# EAGLE design SwitchCombo (EAGLE 9.6.2)
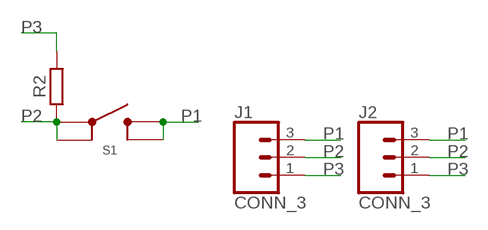
[diagram p0: schematic, sheet 1]

## Parts
J1  CONN_3  [1X03]
J2  CONN_3  [1X03]
R2  10k  R-EU_TH_0.4"  [R_TH_0.4"]
S1  BUTTON6X6_TH  [SWITCH_6MM_TH]

## Nets
P1: J1.3 J2.3 S1.3 S1.4
P2: J1.2 J2.2 R2.P$1 S1.1 S1.2
P3: J1.1 J2.1 R2.P$2

## Library data of the parts
J1 J2 = bschulz:CONN_3: Genaric 3 terminal header Digikey 2.54_SCREW <https://www.digikey.com/product-detail/en/on-shore-technology-inc/OSTVN03A150/ED10562-ND/1588863> 3.5_SCREW <https://www.digikey.com/product-detail/en/on-shore-technology-inc/OSTTE030161/ED2636-ND/614585>
R2 = bschulz_passives:R-EU_: RESISTOR, European symbol Digikey Parts: Yageo, 0402 <https://www.digikey.com/products/en/resistors/chip-resistor-surface-mount/52?k=&pkeyword=&sv=0&s=4356&sf=1&FV=-1%7C13%2C7%7C2%2C1291%7C39157%2C1989%7C0%2C-8%7C52%2C3%7C1131%2C3%7C2503&quantity=&ColumnSort=0&page=1&stock=1&pageSize=25> Yageo, 0603 <https://www.digikey.com/products/en/resistors/chip-resistor-surface-mount/52?k=&pkeyword=&sv=0&pv1291=39245&sf=1&FV=-5%7C4356%2C-5%7C47360%2C-8%7C52%2C-1%7C13%2C7%7C2%2C1989%7C0&quantity=10&ColumnSort=1000011&page=1&stock=1&pageSize=25> Panasonic, 0603 <https://www.digikey.com/products/en/resistors/chip-resistor-surface-mount/52?k=&pkeyword=&pv252=68&sf=0&FV=ffec373d%2C1c0002%2C142c040c%2C1f140000%2Cffe00034%2C80002%2Cc0001&quantity=&ColumnSort=0&page=1&stock=1&pageSize=25> Panasonic, precision, 0603 <https://www.digikey.com/products/en/resistors/chip-resistor-surface-mount/52?FV=ffec4907%2Cfffc000a%2Cc0172%2C142c040c%2C1f140000%2Cffe00034%2C1c0002&quantity=100&ColumnSort=2085&page=1&stock=1&pageSize=25> Panasonic, 0805 <https://www.digikey.com/products/en/resistors/chip-resistor-surface-mount/52?k=&pkeyword=&pv3=1&sf=0&FV=ffec373d%2C1c0002%2C1f140000%2Cffe00034%2C142c040d&quantity=&ColumnSort=0&page=1&stock=1&pageSize=25> Rohm, current sense <https://www.digikey.com/products/en/resistors/chip-resistor-surface-mount/52?k=&pkeyword=&pv3=1&sf=0&FV=ffecb688%2C1f140000%2Cffe00034%2C1c0002&quantity=&ColumnSort=0&page=1&stock=1&pageSize=25> Vishay, pulse proof automotive <https://www.digikey.com/products/en/resistors/chip-resistor-surface-mount/52?k=&pkeyword=&pv7=2&sf=0&FV=ffec5d6b%2Cffe00034%2C1f140000&quantity=&ColumnSort=0&page=1&stock=1&pageSize=25>
S1 = bschulz:BUTTON: Genaric SPST Push button; DIGIKEY: 450-1650-ND; MF: TE Connectivity; MPN: 1825910-6

## Board
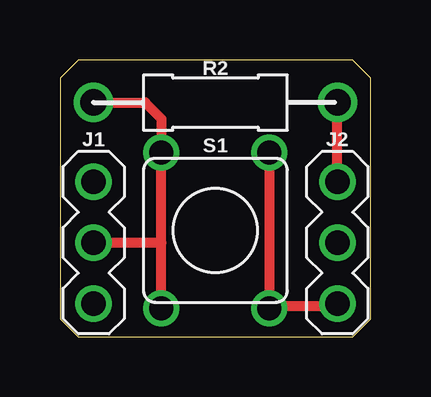
[diagram p1: board, top side]
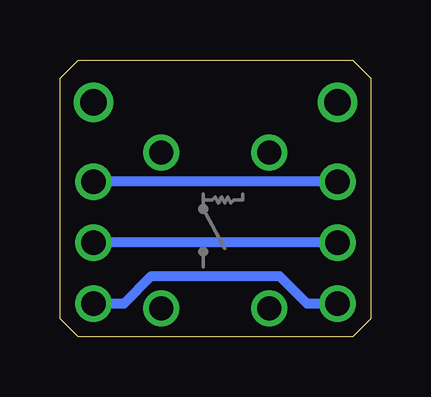
[diagram p2: board, bottom side, seen from below]

Size 12.95 x 11.56 mm. Coordinates in mm from the lower left corner, seen from the top.
Outline: 0.75,0 12.2,0 12.95,0.75 12.95,10.81 12.2,11.56 0.75,11.56 0,10.81 0,0.75 0.75,0
Copper layers (1*16): Top 0.035559375mm / dielectric 1.6mm / Bottom 0.035559375mm
Design rules "oshpark-2layer": minimum track width 6mil, minimum drill 10mil, track to track 6mil, track to pad 6mil, pad to pad 6mil, via to via 6mil, smd to smd 6mil, copper to edge 15mil, drill to drill 6mil, minimum pad ring 5mil, minimum via ring 5mil, stop-mask expansion 2.5mil, vias tented up to drill 0mil, thermal gap 10mil

### Footprints (pad centres in the part's own frame; a part is rotated, then mirrored left to right if it is on the bottom)
1X03 = drill 1.016: 1 -2.54,0; 2 0,0; 3 2.54,0
R_TH_0.4" = drill 1.1: P$1 -5.08,0; P$2 5.08,0
SWITCH_6MM_TH = drill 1: 1 -3.25,2.25; 2 3.25,2.25; 3 -3.25,-2.25; 4 3.25,-2.25

### Placement (x,y rotation side)
J1  1.4,3.94 270 top
J2  11.56,3.94 270 top
R2  6.48,9.78 0 top
S1  6.48,4.45 90 top

### Tracks (layer width: path | path; a pad name or v marks a point on that pad's centre or on a via)
P1
  Top 0.406: S1.4 8.73,1.27 | 8.73,1.27 S1.3 | J2.3 11.43,1.27 8.73,1.27
  Bottom 0.406: J2.3 10.29,1.4 9.14,2.54 3.81,2.54 2.67,1.4 J1.3
P2
  Top 0.406: S1.1 4.23,3.94 | 4.23,3.94 S1.2 4.23,9.11 3.56,9.78 R2.P$1 | J1.2 4.23,3.94
  Bottom 0.406: J1.2 J2.2
P3
  Top 0.406: J2.1 R2.P$2
  Bottom 0.406: J1.1 J2.1

### Text on the board
tDocu: 3 | 3 | 2 | 2 | 1 | 1
bDocu: v0.1 | B. Schulz / Break44 | 3 | 1 | 2